# Altium schematic sheet P03 POWER TREE.SchDoc
size 297 x 209 mm
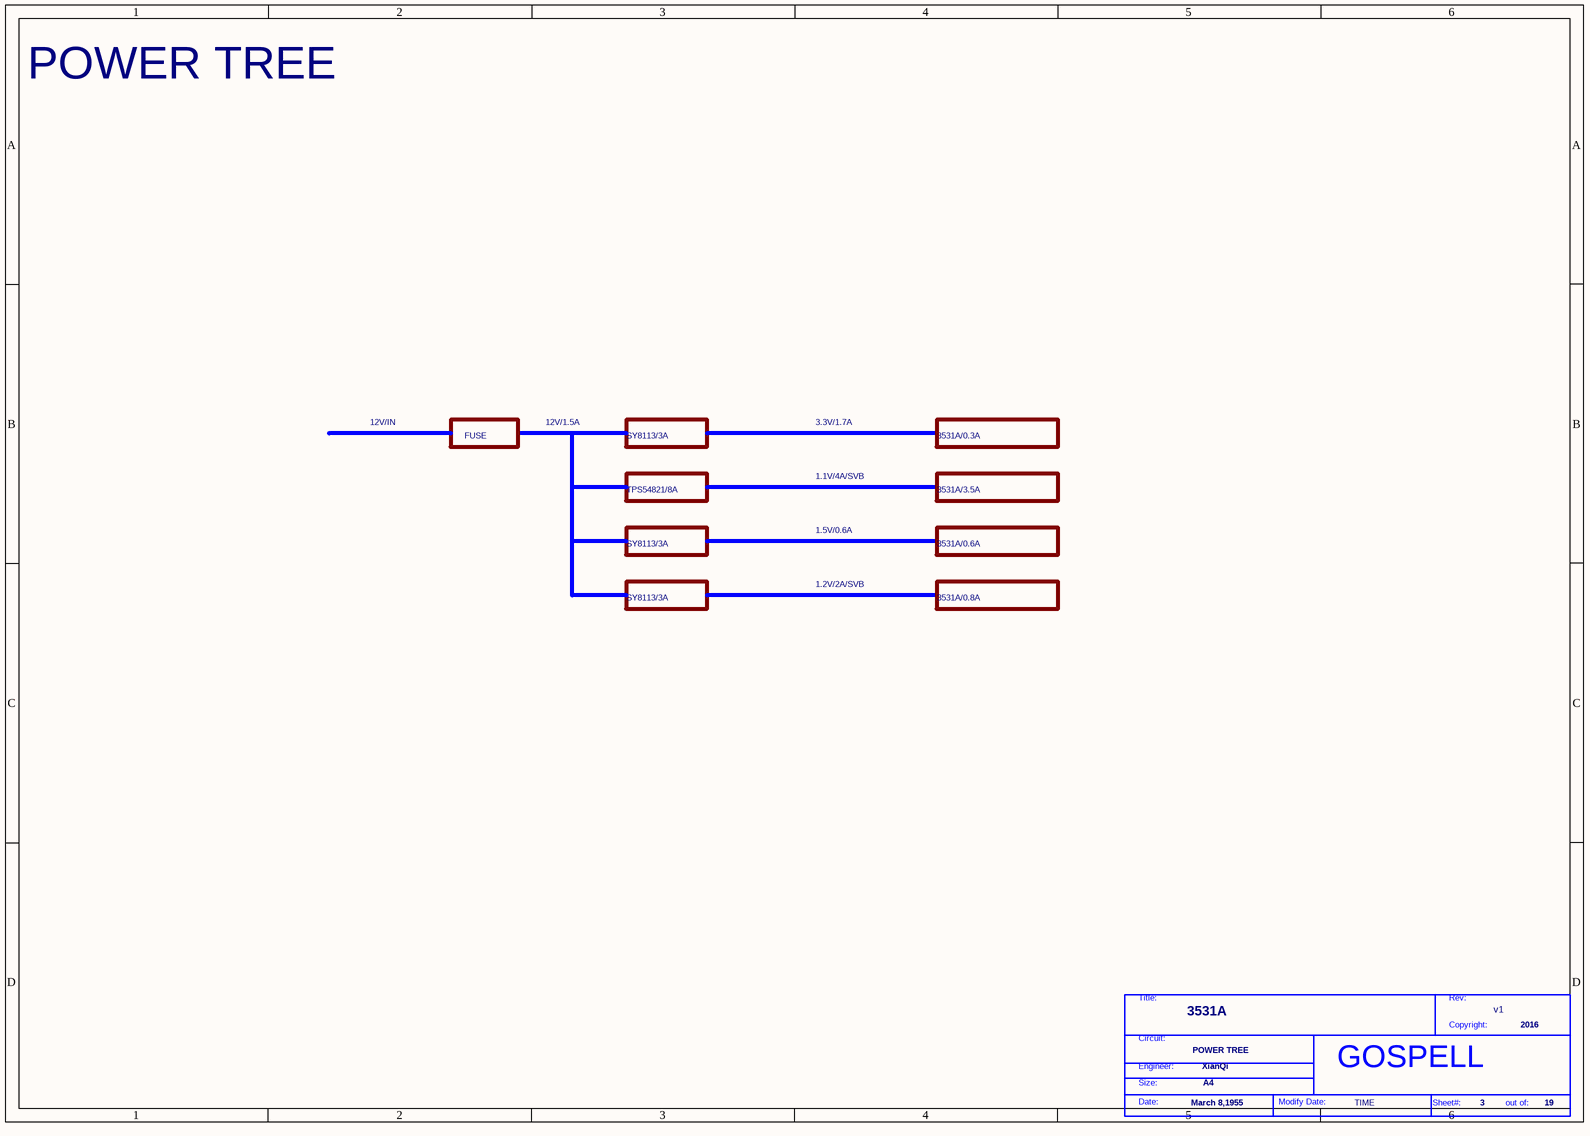
[diagram p0: P03 POWER TREE.SchDoc]

## Parts
*  Page Modify Date: TIME  Engineer: XianQi  Copyright: 2016  Title: 3531A  RevCode: v1  Page Size: A4  Page Create Date: March 8,1955  Page Number: 3  Page Count: 19  Doc: POWER TREE  (hidden comment: GOSPELL)  (graphical)

## Notes on the sheet
- POWER TREE
- 12V/IN
- FUSE
- 12V/1.5A
- SY8113/3A
- 3.3V/1.7A
- 3531A/0.3A
- TPS54821/8A
- 1.5V/0.6A
- 1.1V/4A/SVB
- 3531A/3.5A
- 1.2V/2A/SVB
- 3531A/0.6A
- 3531A/0.8A
- (in symbol GOSPELL) Title:; Rev:; Copyright:; Circuit:; Engineer:; Size:; Date:; Modify Date:; Sheet#:; out of: